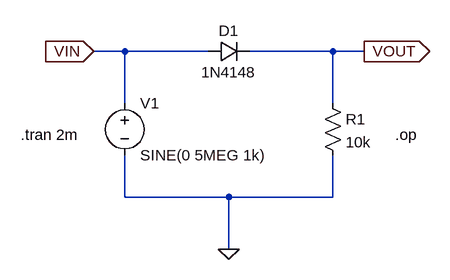
[diagram p0: schematic Draft3.asc]
Draft3.asc, the LTspice schematic file:
Version 4
SHEET 1 880 680
WIRE -32 64 -80 64
WIRE 96 64 -32 64
WIRE 288 64 160 64
WIRE 336 64 288 64
WIRE -32 144 -32 64
WIRE 288 144 288 64
WIRE -32 288 -32 224
WIRE 128 288 -32 288
WIRE 288 288 288 224
WIRE 288 288 128 288
WIRE 128 368 128 288
FLAG 128 368 0
FLAG -80 64 VIN
IOPIN -80 64 In
FLAG 336 64 VOUT
IOPIN 336 64 Out
SYMBOL voltage -32 128 R0
WINDOW 123 0 0 Left 2
WINDOW 39 0 0 Left 2
SYMATTR InstName V1
SYMATTR Value SINE(0 5MEG 1k)
SYMBOL diode 96 80 R270
WINDOW 0 32 32 VTop 2
WINDOW 3 0 32 VBottom 2
SYMATTR InstName D1
SYMATTR Value 1N4148
SYMBOL res 272 128 R0
SYMATTR InstName R1
SYMATTR Value 10k
TEXT -192 192 Left 2 !.tran 2m
TEXT 384 192 Left 2 !.op

The netlist it stands for:
* Draft3.asc
V1 VIN 0 SINE(0 5MEG 1k)
D1 VIN VOUT 1N4148
R1 VOUT 0 10k
.model D D
.lib standard.dio
.tran 2m
.op
.backanno
.end

* Results of the author's LTspice run, read from the files saved beside the schematic
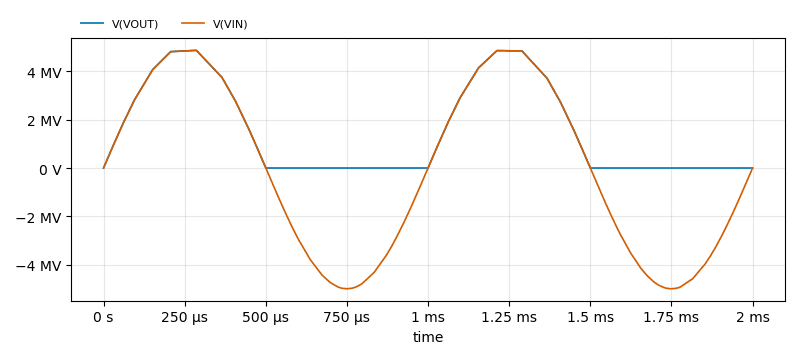
[diagram p1: Transient Analysis of Draft3.asc, plotted from the saved traces]
* Transient Analysis, 1 run:
*   V(VOUT): min -659.4 V, max 4.87 MV, average 1.57 MV, rms 2.476 MV, last 129.5 V
*   V(VIN): min -5 MV, max 4.87 MV, average -18.06 kV, rms 3.517 MV, last 0 V